# EAGLE design Own_18650_Board_v1.2_Final_AR (EAGLE 9.6.2)
COMPANY: ADAFRUIT INDUSTRIES; DRAWN: KTOWN; REV: A; YEAR: 2019
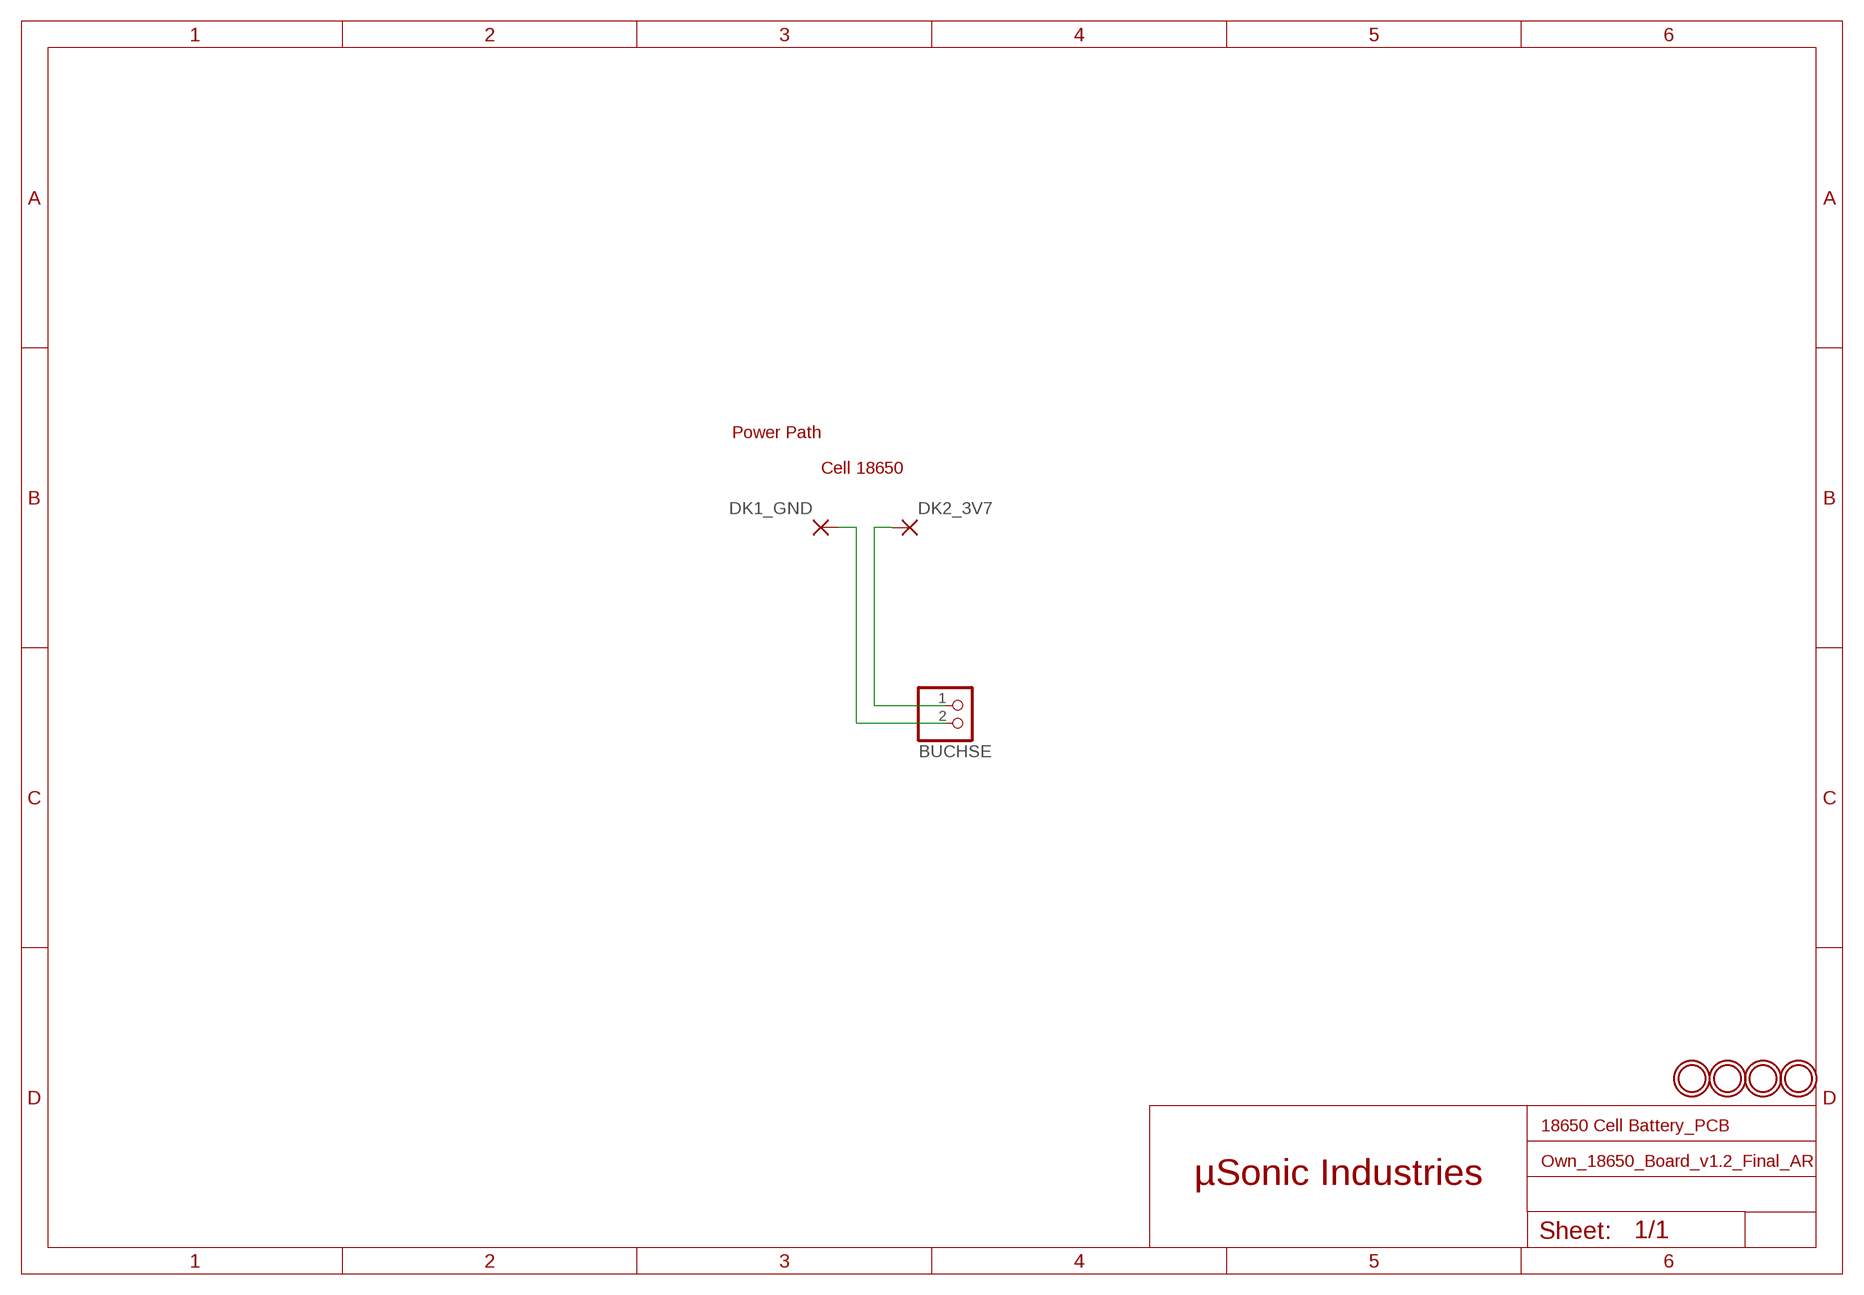
[diagram p0: schematic, sheet 1]

## Parts
BUCHSE  JST_2PINOWN  [JST-PH-2-THMOWN]
DK1_GND  3,17/1,3  [3,17/1,3]
DK2_3V7  3,17/1,3  [3,17/1,3]
U$1  MOUNTINGHOLE2.5  [MOUNTINGHOLE_2.5_PLATED]
U$2  MOUNTINGHOLE2.5  [MOUNTINGHOLE_2.5_PLATED]
U$3  MOUNTINGHOLE2.5  [MOUNTINGHOLE_2.5_PLATED]
U$5  MOUNTINGHOLE2.5  [MOUNTINGHOLE_2.5_PLATED]

## Nets
3V7: BUCHSE.1 DK2_3V7.1(P)
GND: BUCHSE.2 DK1_GND.1(P)

## Notes on the sheet
- Power Path
- Cell 18650
- 18650 Cell Battery_PCB
- µSonic Industries

## Library data of the parts
BUCHSE = adafruit2:JST_2PIN: JST 2-Pin Connectors of various flavors SMT-RA (S2B-PH-SM4) 4UConnector #17311 SMT (B2B-PH-SM4) THM-RA (S2B-PH) THM (B2B-PH)
DK1_GND DK2_3V7 = wirepad:3,17/1,3: THROUGH-HOLE PAD
U$1-U$3 U$5 = microbuilder:MOUNTINGHOLE: Mounting Hole For #2 screws (0.086"/2.18mm width, 0.094"/2.4mm hole) use 2.5mm; BOM: EXCLUDE

## Net classes
0 default: width 0.25 mm

## Board
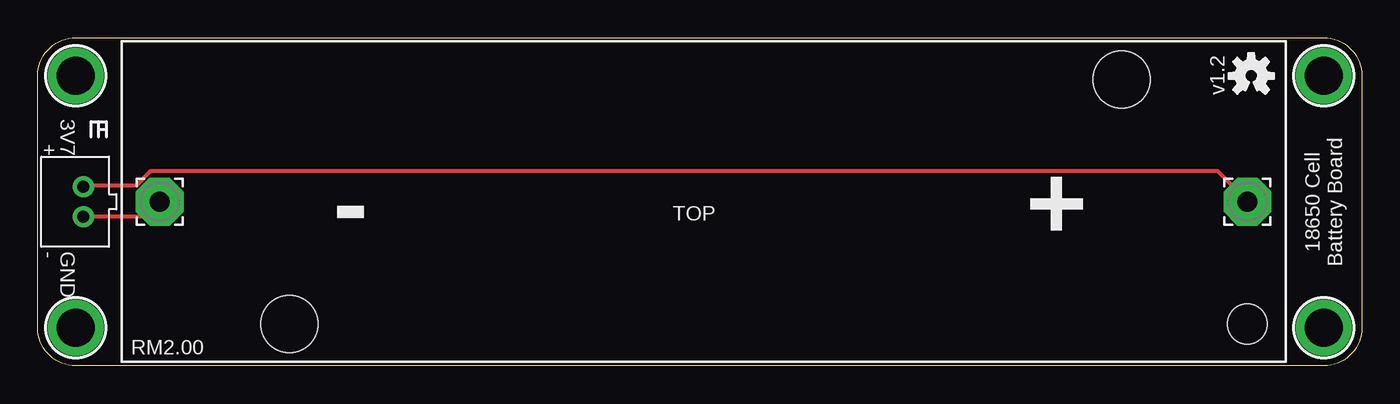
[diagram p1: board, top side]
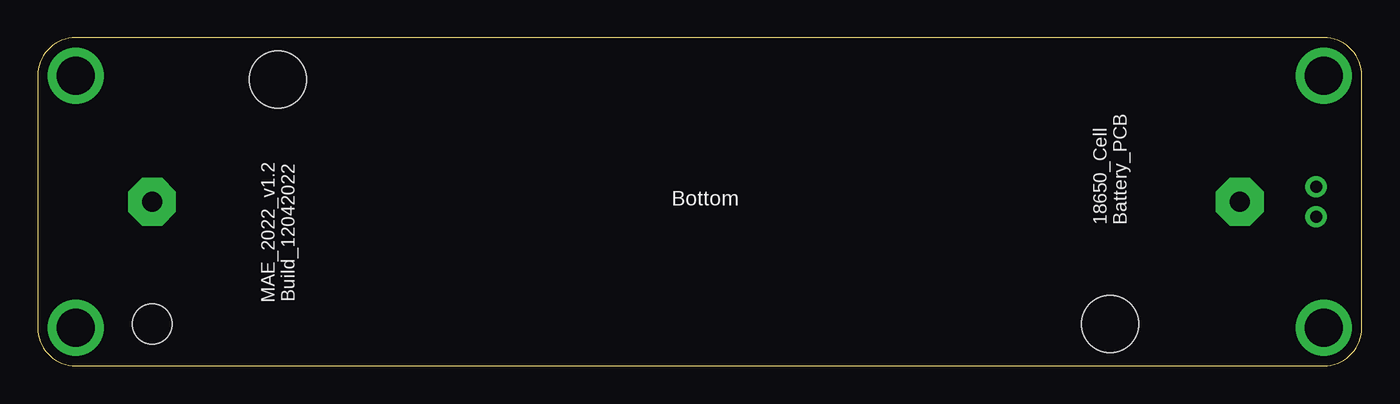
[diagram p2: board, bottom side, seen from below]

Size 88.14 x 21.84 mm. Coordinates in mm from the lower left corner, seen from the top.
Outline: 88.14,19.3 88.14,2.54 arc-90 85.6,0 2.54,0 arc-90 0,2.54 0,19.3 arc-90 2.54,21.84 85.6,21.84 arc-90 88.14,19.3
Copper layers (1*16): Top 0.035mm / dielectric 1.5mm / Bottom 0.035mm
Design rules "aisler_2_layer_complex": minimum track width 0.125mm, minimum drill 0.2mm, track to track 0.125mm, track to pad 0.125mm, pad to pad 0.125mm, via to via 0.125mm, smd to smd 0.125mm, copper to edge 0.3mm, drill to drill 0.25mm, minimum pad ring 0.2mm, minimum via ring 0.2mm, stop-mask expansion 0mil, vias tented up to drill 0mil, thermal gap 10mil
Holes 2.64 mm at 80.52,2.79
Holes 3.8 mm at 72.14,19.05 16.76,2.79

### Footprints (pad centres in the part's own frame; a part is rotated, then mirrored left to right if it is on the bottom)
JST-PH-2-THMOWN = drill 0.8 pad 1.422: 1 1,0; 2 -1,0
3,17/1,3 = drill 1.321 pad 3.175 octagon: 1 0,0
MOUNTINGHOLE_2.5_PLATED = drill 2.5 pad 3.2: P$1 0,0

### Placement (x,y rotation side)
BUCHSE  3.05,10.92 90 top
DK1_GND  8.13,10.92 0 top
DK2_3V7  80.52,10.92 0 top
U$1  85.6,19.3 180 top
U$2  2.54,19.3 180 top
U$3  85.6,2.54 0 top
U$4  [OSHW-LOGO-S]  80.77,19.3 0 top
U$5  2.54,2.54 0 top

### Tracks (layer width: path | path; a pad name or v marks a point on that pad's centre or on a via)
3V7
  Top 0.25: BUCHSE.1 3.19,12 6.56,12 7.5,12.94 78.56,12.94 80.44,11.06 DK2_3V7.1
GND
  Top 0.25: BUCHSE.2 3.19,9.94 7.12,9.94 8.06,10.88 DK1_GND.1

### Text on the board
tPlace: v1.2 | 3V7 / + | - | TOP | + | 18650 Cell / Battery Board | GND / - | RM2.00
bPlace: Bottom | 18650_Cell / Battery_PCB | MAE_2022_v1.2 / Build_12042022